# Altium project MCORD_AFE.PrjPCB (part 2 of 2)

## Sheet Supply.SchDoc: MCORD AFE
size 420 x 297 mm; Author: G.Kasprowicz; CompanyName: WUT ISE; DrawnBy: G.Kasprowicz; Organization: WUT ISE; Address1: PW ISE; Address2: Nowowiejska 15/19 00-665 Warsaw; Address3: gkasprow@gmail.com; DocumentNumber: 4; Revision: 2; SheetNumber: 4; SheetTotal: 4; ModifiedBy: -; CheckedDate: -; Title2: LDO; DivGrp: WUT ISE; Designer: G.Kasprowicz; ModifiedDate: -; ProjectName: Sensor Box
Used 2 times, as channels U_Supply0, U_Supply1. Parts and nets are listed once, with the designators drawn on the sheet.
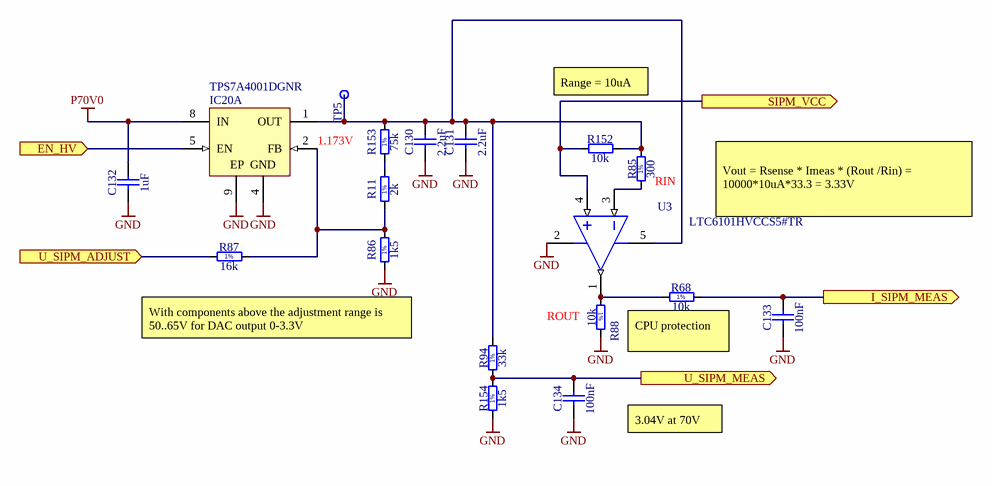
[diagram p3: Supply.SchDoc]

### Parts
C130  2.2uF  [CAPC3225X230N]
C131  2.2uF  [CAPC3225X230N]
C132  1uF  [CAPC2013X145N]
C133  100nF  [CAPC1005X55N]
C134  100nF  [CAPC1005X55N]
IC20  TPS7A4001DGNR  [DGN0008B_M]  (part A of 2)
R11  2k  [RESC1005X40N]
R68  10k  [RESC1005X40N]
R85  300  [RESC1005X40N]
R86  1k5  [RESC1005X40N]
R87  16k  [RESC1005X40N]
R88  10k  [RESC1005X40N]
R94  33k  [RESC2012X60N]
R152  10k  [RESC1608X55N]
R153  75k  [RESC1608X55N]
R154  1k5  [RESC1005X40N]
TP5  Test Point  [TPS127]  (value not drawn)
U3  LTC6101HVCCS5#TR  [LT-S5-5-TSOT-23_M]

### Ports
EN_HV (in), I_SIPM_MEAS (out), SIPM_VCC (out), U_SIPM_ADJUST (in), U_SIPM_MEAS (out)

### Nets
GND: C130.1 C131.1 C132.1 C133.1 C134.1 IC20.4(GND) IC20.9(EP) R86.1 R88.2 R154.1 U3.2(V-)
P70V0: C132.2 IC20.8(IN)
EN_HV: IC20.5(EN) ; port EN_HV
I_SIPM_MEAS: C133.2 R68.2 ; port I_SIPM_MEAS
SIPM_VCC: R152.1 U3.4(+IN) ; port SIPM_VCC
U_SIPM_ADJUST: R87.1 ; port U_SIPM_ADJUST
U_SIPM_MEAS: C134.2 R94.1 R154.2 ; port U_SIPM_MEAS
NetC130_2: C130.2 C131.2 IC20.1(OUT) R85.2 R94.2 R152.2 R153.2 TP5.1 U3.5(V+)
NetIC20_2: IC20.2(FB) R11.1 R86.2 R87.2
NetR11_2: R11.2 R153.1
NetR68_1: R68.1 R88.1 U3.1(OUT)
NetR85_1: R85.1 U3.3(-IN)

### Channels
U_Supply0: designators end in A; ports EN_HV=EN_HV0 I_SIPM_MEAS=I_SIPM_MEAS0 SIPM_VCC=NetR44_2 U_SIPM_ADJUST=U_SIPM_ADJUST0 U_SIPM_MEAS=U_SIPM_MEAS0
U_Supply1: designators end in B; ports EN_HV=EN_HV1 I_SIPM_MEAS=I_SIPM_MEAS1 SIPM_VCC=SIPM_VCC_EXT U_SIPM_ADJUST=U_SIPM_ADJUST1 U_SIPM_MEAS=U_SIPM_MEAS1

### Notes on the sheet
- 1.173V
- Range = 10uA
- (near R85) RIN
- Vout = Rsense * Imeas * (Rout /Rin) = 10000*10uA*33.3 = 3.33V
- With components above the adjustment range is 50..65V for DAC output 0-3.3V
- ROUT
- (near R68) CPU protection
- 3.04V at 70V
- Project/Equipment
- Document
- Designer
- Drawn by
- Check.by
- Copyright WUT ISE 2018.
  This documentation describes Open Hardware and is licensed under the CERN OHL v.1.1. You may redistribute and modify this documentation under the terms of the CERN OHL v.1.1. (http://ohwr.org/CERNOHL). This documentation is distributed WITHOUT ANY EXPRESS OR IMPLIED WARRANTY, INCLUDING OF MERCHANTABILITY, SATISFACTORY QUALITY AND FITNESS FOR A PARTICULAR PURPOSE. Please see the CERN OHL v.1.1 for applicable conditions.
- Contact
- File
- Last Mod.
- Print Date
- Sheet
- Size
- A3
- of
- Rev
- (in symbol R0402_1K5_1%_0.0625W_100PPM) 1%
- (in symbol R0402_2k_1%_0.0625W_100PPM) 1%
- (in symbol R0402_10K_1%_0.0625W_100PPM) 1%
- (in symbol R0402_16K_1%_0.0625W_100PPM) 1%
- (in symbol R0402_300R_1%_0.0625W_100PPM) 1%
- (in symbol R0603_75K_1%_0.1W_100PPM) 1%
- (in symbol R0805_33K_1%_0.125W_100PPM) 1%

### Library data of the parts
C130 C131 = CC1210_2.2UF_100V_10%_X7R_MURATA_GCJ32DR72A225KA01L: Non-polarised capacitor; Part Description: Soft Termination SMD Chip Monolithic Ceramic Capacitor for Automotive; Manufacturer: MURATA; Voltage: 100V; TC: X7R; Tolerance: ±10%; Part Number: CC1210_2.2UF_100V_10%_X7R_MURATA_GCJ32DR72A225KA01L; Component Kind: Standard; Component Type: Standard; Pin Count: 2; Value: 2.2uF; Status: Not Recommended; Manufacturer Part Number: GCJ32DR72A225KA01L; Case: 1210; Mounted: Yes; Socket: No; SMD: Yes; Sense: No; HelpURL: \\cern.ch\dfs\Applications\Altium\Datasheets\CC1210_MURATA_GCJ32DR72A225KA01L.pdf; Author: CERN DEM JLC; CreateDate: 10.05.2017; LatestRevisionDate: 10.05.2017; ComponentHeight: 2.3mm
C132 = CC0805_1UF_100V_10%_X7S: Non-polarised capacitor; Part Description: SMD Multilayer Chip Ceramic Capacitor; Manufacturer: TDK; Manufacturer Part Number: C2012X7S2A105K125AB; Voltage: 100V; TC: X7S; Tolerance: ±10%; Part Number: CC0805_1UF_100V_10%_X7S; Component Kind: Standard; Component Type: Standard; Pin Count: 2; Value: 1uF; Status: None; Case: 0805; Mounted: Yes; Socket: No; SMD: Yes; Sense: No; ComponentHeight: 1.45mm; HelpURL: \\cern.ch\dfs\Applications\Altium\Datasheets\CC0805_X7S_TDK_C.pdf; Author: CERN DEM JLC; CreateDate: 12.12.2013; LatestRevisionDate: 20.01.2015
C133 C134 = CC0402_100NF_16V_10%_X7R: Non-polarised capacitor; Part Description: SMD Multilayer Chip Ceramic Capacitor; Manufacturer: GENERIC; Manufacturer1 Part Number: GRM155R71C104KA88D; Voltage: 16V; TC: X7R; Tolerance: ±10%; Part Number: CC0402_100NF_16V_10%_X7R; Component Kind: Standard; Component Type: Standard; Pin Count: 2; Value: 100nF; Status: Not Recommended; Manufacturer Part Number: CC0402_100NF_16V_10%_X7R; Case: 0402; Mounted: Yes; Socket: No; SMD: Yes; Sense: No; HelpURL: \\cern.ch\dfs\Applications\Altium\Datasheets\CC0402_X7R_MURATA_GRM.pdf; Author: CERN DEM JLC; CreateDate: 05.12.2013; LatestRevisionDate: 03.12.2007; Manufacturer1 Example: MURATA; Manufacturer1 ComponentHeight: 0.55mm
IC20 = CMP-0394-01258-2: Single Output LDO, 50 mA, Adjustable 1.175 to 90 V Output, 7 to 100 V Input, 8-pin MSOP (DGN), -40 to 125 degC, Green (RoHS & no Sb/Br); Manufacturer: Texas Instruments; Iout(Max)(A): 0.05; Vin(Max)(V): 100; Vout Adj(Min)(V): 1.2; Accuracy(%): 2.5; SubFamily: Single Channel LDO; Vin(Min)(V): 7; Iq(Typ)(mA): 0.02; Vdo(Typ)(mV): 290; Vout Adj(Max)(V): 90; ComponentLink1URL: http://www.ti.com/; PackageDescription: 8-Pin Plastic Small Outline, Body 3 x 3 mm, Pitch 0.65 mm; PartNumber: TPS7A4001DGNR; Mounting Technology: Surface Mount; PackageReference: DGN0008B; ComponentLink1Description: Manufacturer URL; Code_JEDEC: MO-187; DatasheetVersion: SBVS162A; ComponentLink2URL: http://www.ti.com/general/docs/lit/getliterature.tsp?genericPartNumber=TPS7A4001&fileType=pdf; ComponentLink2Description: Datasheet; Eco-Plan: Green (RoHS & no Sb/Br); PackageVersion: 4073271/F; ComponentLink3URL: http://www.ti.com/litv/pdf/mpds046e; ComponentLink3Description: Package Specification
R11 = R0402_2k_1%_0.0625W_100PPM: Resistor - 1%; Part Description: General Purpose Thick Film Chip Resistor; Manufacturer: GENERIC; Manufacturer1 Part Number: 232270672002L; TC: ±100ppm/°C; PressFit: No; Part Number: R0402_2K_1%_0.0625W_100PPM; Component Kind: Standard; Component Type: Standard; Pin Count: 2; Value: 2k; Status: Not Recommended; Power: 0.0625W; Tolerance: ±1%; Manufacturer Part Number: R0402_2K_1%_0.0625W_100PPM; Case: 0402; Mounted: Yes; Sense: No; Socket: No; SMD: Yes; Manufacturer1 Example: YAGEO PHYCOMP; Manufacturer1 ComponentHeight: 0.4mm; HelpURL: \\cern.ch\dfs\Applications\Altium\Datasheets\R0402_Phycomp_RC0402.pdf; Author: CERN DEM JLC; CreateDate: 03/12/2007; LatestRevisionDate: 17/10/2012
R68 R88 = R0402_10K_1%_0.0625W_100PPM: Resistor - 1%; Part Description: General Purpose Thick Film Chip Resistor; Manufacturer: GENERIC; Manufacturer1 Part Number: 232270671003L; TC: ±100ppm/°C; PressFit: No; Part Number: R0402_10K_1%_0.0625W_100PPM; Component Kind: Standard; Component Type: Standard; Pin Count: 2; Value: 10k; Status: Not Recommended; Power: 0.0625W; Tolerance: ±1%; Manufacturer Part Number: R0402_10K_1%_0.0625W_100PPM; Case: 0402; Mounted: Yes; Sense: No; Socket: No; SMD: Yes; Manufacturer1 Example: YAGEO PHYCOMP; Manufacturer1 ComponentHeight: 0.4mm; HelpURL: \\cern.ch\dfs\Applications\Altium\Datasheets\R0402_Phycomp_RC0402.pdf; Author: CERN DEM JLC; CreateDate: 03.12.2007; LatestRevisionDate: 17.10.2012
R85 = R0402_300R_1%_0.0625W_100PPM: Resistor - 1%; Part Description: General Purpose Thick Film Chip Resistor; Manufacturer: GENERIC; Manufacturer1 Part Number: 232270673001L; TC: ±100ppm/°C; PressFit: No; Part Number: R0402_300R_1%_0.0625W_100PPM; Component Kind: Standard; Component Type: Standard; Pin Count: 2; Value: 300; Status: Not Recommended; Power: 0.0625W; Tolerance: ±1%; Manufacturer Part Number: R0402_300R_1%_0.0625W_100PPM; Case: 0402; Mounted: Yes; Sense: No; Socket: No; SMD: Yes; Manufacturer1 Example: YAGEO PHYCOMP; Manufacturer1 ComponentHeight: 0.4mm; HelpURL: \\cern.ch\dfs\Applications\Altium\Datasheets\R0402_Phycomp_RC0402.pdf; Author: CERN DEM JLC; CreateDate: 03.12.2007; LatestRevisionDate: 17.10.2012
R86 R154 = R0402_1K5_1%_0.0625W_100PPM: Resistor - 1%; Part Description: General Purpose Thick Film Chip Resistor; Manufacturer: GENERIC; Manufacturer1 Part Number: 232270671502L; TC: ±100ppm/°C; PressFit: No; Part Number: R0402_1K5_1%_0.0625W_100PPM; Component Kind: Standard; Component Type: Standard; Pin Count: 2; Value: 1k5; Status: Not Recommended; Power: 0.0625W; Tolerance: ±1%; Manufacturer Part Number: R0402_1K5_1%_0.0625W_100PPM; Case: 0402; Mounted: Yes; Sense: No; Socket: No; SMD: Yes; Manufacturer1 Example: YAGEO PHYCOMP; Manufacturer1 ComponentHeight: 0.4mm; HelpURL: \\cern.ch\dfs\Applications\Altium\Datasheets\R0402_Phycomp_RC0402.pdf; Author: CERN DEM JLC; CreateDate: 03.12.2007; LatestRevisionDate: 17.10.2012
R87 = R0402_16K_1%_0.0625W_100PPM: Resistor - 1%; Part Description: General Purpose Thick Film Chip Resistor; Manufacturer: GENERIC; Manufacturer1 Part Number: 232270671603L; TC: ±100ppm/°C; PressFit: No; Part Number: R0402_16K_1%_0.0625W_100PPM; Component Kind: Standard; Component Type: Standard; Pin Count: 2; Value: 16k; Status: Not Recommended; Power: 0.0625W; Tolerance: ±1%; Manufacturer Part Number: R0402_16K_1%_0.0625W_100PPM; Case: 0402; Mounted: Yes; Sense: No; Socket: No; SMD: Yes; Manufacturer1 Example: YAGEO PHYCOMP; Manufacturer1 ComponentHeight: 0.4mm; HelpURL: \\cern.ch\dfs\Applications\Altium\Datasheets\R0402_Phycomp_RC0402.pdf; Author: CERN DEM JLC; CreateDate: 03/12/2007; LatestRevisionDate: 17/10/2012
R94 = R0805_33K_1%_0.125W_100PPM: Resistor - 1%; Part Description: General Purpose Thick Film Chip Resistor; Manufacturer: GENERIC; Manufacturer1 Part Number: NRC10F3302TRF; Power: 0.125W; TC: ±100ppm/°C; PressFit: No; Part Number: R0805_33K_1%_0.125W_100PPM; Component Kind: Standard; Component Type: Standard; Pin Count: 2; Value: 33k; Status: Preferred; Tolerance: ±1%; Manufacturer Part Number: R0805_33K_1%_0.125W_100PPM; Case: 0805; Mounted: Yes; Sense: No; Socket: No; SMD: Yes; Manufacturer1 Example: NIC COMPONENT; Manufacturer1 ComponentHeight: 0.6mm; HelpURL: \\cern.ch\dfs\Applications\Altium\Datasheets\R0805_NIC_NRC.pdf; Author: CERN DEM JLC; CreateDate: 03.12.2007; LatestRevisionDate: 13.03.2008
R152 = R0603_10k_1%_0.1W_100PPM: Resistor - 1%; Part Description: General Purpose Thick Film Chip Resistor; Manufacturer: GENERIC; Manufacturer1 Part Number: NRC06F1002TRF; Power: 0.1W; TC: ±100ppm/°C; PressFit: No; Part Number: R0603_10K_1%_0.1W_100PPM; Component Kind: Standard; Component Type: Standard; Pin Count: 2; Value: 10k; Status: Preferred; Tolerance: ±1%; Manufacturer Part Number: R0603_10K_1%_0.1W_100PPM; Case: 0603; Mounted: Yes; Sense: No; Socket: No; SMD: Yes; Manufacturer1 Example: NIC COMPONENT; Manufacturer1 ComponentHeight: 0.55mm; HelpURL: \\cern.ch\dfs\Applications\Altium\Datasheets\R0603_NIC_NRC.pdf; Author: CERN DEM JLC; CreateDate: 03.12.2007; LatestRevisionDate: 13.03.2008
R153 = R0603_75K_1%_0.1W_100PPM: Resistor - 1%; Part Description: General Purpose Thick Film Chip Resistor; Manufacturer: GENERIC; Manufacturer1 Part Number: NRC06F7502TRF; Power: 0.1W; TC: ±100ppm/°C; PressFit: No; Part Number: R0603_75K_1%_0.1W_100PPM; Component Kind: Standard; Component Type: Standard; Pin Count: 2; Value: 75k; Status: Preferred; Tolerance: ±1%; Manufacturer Part Number: R0603_75K_1%_0.1W_100PPM; Case: 0603; Mounted: Yes; Sense: No; Socket: No; SMD: Yes; Manufacturer1 Example: NIC COMPONENT; Manufacturer1 ComponentHeight: 0.55mm; HelpURL: \\cern.ch\dfs\Applications\Altium\Datasheets\R0603_NIC_NRC.pdf; Author: CERN DEM JLC; CreateDate: 03.12.2007; LatestRevisionDate: 13.03.2008
TP5 = SMD_PAD_1.27X1.27MM: Part Description: 1.27mm x 1.27mm PCB Copper Area (SMD Test Point); Mounted: No; Part Number: SMD_PAD_1.27X1.27MM; Component Kind: Standard (No BOM); Component Type: Standard (No BOM); Pin Count: 1; Family: Test Point; Socket: No; SMD: Yes; Sense: No; Status: None; ComponentHeight: 0mm; HelpURL: Undefined; Author: CERN DEM JLC; CreateDate: 12.01.2008; LatestRevisionDate: 12.01.2008; PackageDescription: 1.27mm x 1.27mm PCB Copper Area (SMD Test Point)
U3 = CMP-0359-01901-2: Single Channel, High Voltage, High-Side Current Sense Operational Amplifier, 0.2 MHz Typical GBW, 4 to 60 V, 5-Pin SOT23 (S5-5), Commercial, Reel; Manufacturer: Linear Technology; Channels (#): 1; GBW (MHz) Typical: 0.2; Is (mA) Typical: 0.22; Vs Min (V): 4; Vs Max (V): 60; Vos (mV) Typical: 0.15; Code_JEDEC: MO-193; ComponentLink3URL: http://cds.linear.com/docs/en/packaging/SOT_5_05-08-1635.pdf; ComponentLink2URL: http://cds.linear.com/docs/en/datasheet/6101fh.pdf; PackageDescription: 5-Lead Plastic TSOT-23, Body 1.63 x 2.90 mm, Pitch 0.95 mm; ComponentLink3Description: Package Specification; PartNumber: LTC6101HVCCS5#TR; ComponentLink1Description: Manufacturer URL; Packing: Reel; Linear Technology Part Number: LTC6101HV; DatasheetVersion: Rev. H; ComponentLink1URL: http://www.linear.com/; ComponentLink2Description: Datasheet; Type: CSA; PackageReference: LT-S5-5-TSOT-23; Mounting Technology: Surface Mount; RevisionNote: URLs updated

## Nets that join several sheets
GND: MCORD_AFE (31 pins), CAN_controller (38 pins), Detector (19 pins), U_Supply0 (11 pins), U_Supply1 (11 pins)
P3V3: MCORD_AFE (10 pins), CAN_controller (18 pins)
P5V0: MCORD_AFE (5 pins), CAN_controller (8 pins), Detector (J3.3 L1.2 L6.2)
P70V0: MCORD_AFE (J1.A8 J1.B8), U_Supply0 (C132A.2 IC20A.8), U_Supply1 (C132B.2 IC20B.8)
AFE0_OFFSET: CAN_controller (IC1.4), Detector (C6.2 R51.2 R106.2)
AFE1_OFFSET: MCORD_AFE (J2.10), CAN_controller (IC1.12)
CAN_H: MCORD_AFE (J1.A2), CAN_controller (D121.1 IC3.7 TP1.1)
CAN_L: MCORD_AFE (J1.A3), CAN_controller (D121.2 IC3.6 TP2.1)
CC1: MCORD_AFE (R13.1), CAN_controller (U1.25)
CC2: MCORD_AFE (R12.1), CAN_controller (U1.26)
DC_LEVEL_MEAS0: MCORD_AFE (R9.1), CAN_controller (C42.2 U1.10)
DC_LEVEL_MEAS1: MCORD_AFE (R10.2), CAN_controller (C43.2 U1.11)
DET_OUT0_N: MCORD_AFE (J1.A10), Detector (R103.2)
DET_OUT0_P: MCORD_AFE (J1.A11 R9.2), Detector (R48.2)
EN_CAL_PULSE0: MCORD_AFE (R67.1 T5.1), CAN_controller (U1.28)
EN_CAL_PULSE1: MCORD_AFE (R63.1 T4.1), CAN_controller (U1.27)
EN_HV0: CAN_controller (U1.22), U_Supply0 (IC20A.5)
EN_HV1: CAN_controller (U1.21), U_Supply1 (IC20B.5)
I_SIPM_MEAS0: CAN_controller (U1.16), U_Supply0 (C133A.2 R68A.2)
I_SIPM_MEAS1: CAN_controller (U1.17), U_Supply1 (C133B.2 R68B.2)
NetC99_1: MCORD_AFE (IC5.10 R66.2), Detector (C99.1 R71.2)
NetR1_1: MCORD_AFE (R1.1 T1.3), CAN_controller (U1.44)
NetR44_2: Detector (R44.2), U_Supply0 (R152A.1 U3A.4)
SIPM_VCC_EXT: MCORD_AFE (J2.7), U_Supply1 (R152B.1 U3B.4)
TEMP_EXT: MCORD_AFE (J2.8), CAN_controller (C3.2 U1.18)
TEMP_LOCAL: CAN_controller (C5.2 U1.19), Detector (J3.2)
U_SIPM_ADJUST0: CAN_controller (U1.14), U_Supply0 (R87A.1)
U_SIPM_ADJUST1: CAN_controller (U1.15), U_Supply1 (R87B.1)
U_SIPM_MEAS0: CAN_controller (U1.12), U_Supply0 (C134A.2 R94A.1 R154A.2)
U_SIPM_MEAS1: CAN_controller (U1.13), U_Supply1 (C134B.2 R94B.1 R154B.2)
USB_D_N: MCORD_AFE (J1.A7 J1.B7), CAN_controller (U1.32)
USB_D_P: MCORD_AFE (J1.A6 J1.B6), CAN_controller (U1.33)